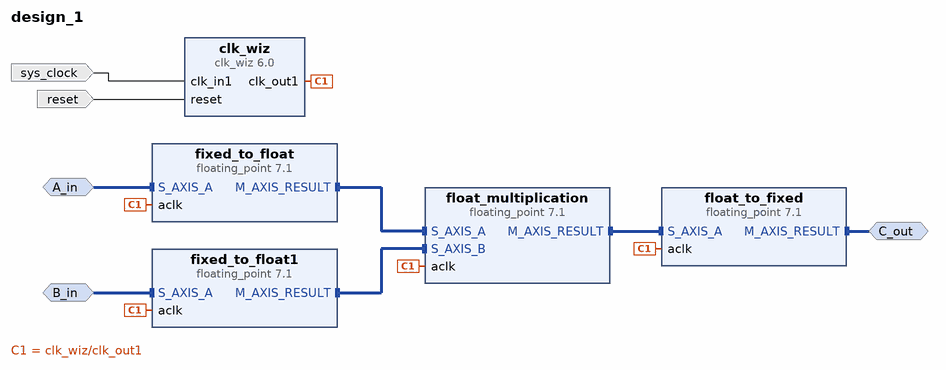
[diagram p0: block diagram of the top level]
# Vivado block design design_1, xc7a35tcpg236-1, Vivado 2019.2
create_bd_design design_1

create_bd_intf_port -mode Slave -vlnv xilinx.com:interface:axis_rtl:1.0 A_in
set_property -dict [list \
  CONFIG.TDATA_NUM_BYTES 4 \
  CONFIG.TDEST_WIDTH 0 \
  CONFIG.TID_WIDTH 0 \
  CONFIG.TUSER_WIDTH 0 \
  CONFIG.HAS_TREADY 1 \
  CONFIG.HAS_TSTRB 0 \
  CONFIG.HAS_TKEEP 0 \
  CONFIG.HAS_TLAST 0 \
  CONFIG.LAYERED_METADATA undef \
] [get_bd_intf_ports A_in]
create_bd_intf_port -mode Slave -vlnv xilinx.com:interface:axis_rtl:1.0 B_in
set_property -dict [list \
  CONFIG.TDATA_NUM_BYTES 4 \
  CONFIG.TDEST_WIDTH 0 \
  CONFIG.TID_WIDTH 0 \
  CONFIG.TUSER_WIDTH 0 \
  CONFIG.HAS_TREADY 1 \
  CONFIG.HAS_TSTRB 0 \
  CONFIG.HAS_TKEEP 0 \
  CONFIG.HAS_TLAST 0 \
  CONFIG.LAYERED_METADATA undef \
] [get_bd_intf_ports B_in]
create_bd_intf_port -mode Master -vlnv xilinx.com:interface:axis_rtl:1.0 C_out
create_bd_port -dir I -type clk sys_clock
set_property -dict {CONFIG.ASSOCIATED_BUSIF A_in:B_in CONFIG.FREQ_HZ 100000000 CONFIG.PHASE 0.000} [get_bd_ports sys_clock]
create_bd_port -dir I -type rst reset
set_property -dict {CONFIG.POLARITY ACTIVE_HIGH} [get_bd_ports reset]

create_bd_cell -type ip -vlnv xilinx.com:ip:floating_point:7.1 float_to_fixed
set_property -dict [list \
  CONFIG.C_Latency 7 \
  CONFIG.C_Mult_Usage No_Usage \
  CONFIG.C_Rate 1 \
  CONFIG.C_Result_Exponent_Width 32 \
  CONFIG.C_Result_Fraction_Width 0 \
  CONFIG.Operation_Type Float_to_fixed \
  CONFIG.Result_Precision_Type Int32 \
] [get_bd_cells float_to_fixed]
create_bd_cell -type ip -vlnv xilinx.com:ip:floating_point:7.1 fixed_to_float
set_property -dict [list \
  CONFIG.C_Accum_Input_Msb 32 \
  CONFIG.C_Accum_Lsb -31 \
  CONFIG.C_Accum_Msb 32 \
  CONFIG.C_Latency 7 \
  CONFIG.C_Mult_Usage No_Usage \
  CONFIG.C_Rate 1 \
  CONFIG.C_Result_Exponent_Width 8 \
  CONFIG.C_Result_Fraction_Width 24 \
  CONFIG.Operation_Type Fixed_to_float \
  CONFIG.Result_Precision_Type Single \
] [get_bd_cells fixed_to_float]
create_bd_cell -type ip -vlnv xilinx.com:ip:floating_point:7.1 float_multiplication
set_property -dict [list \
  CONFIG.C_Latency 9 \
  CONFIG.C_Mult_Usage Full_Usage \
  CONFIG.C_Rate 1 \
  CONFIG.C_Result_Exponent_Width 8 \
  CONFIG.C_Result_Fraction_Width 24 \
  CONFIG.Operation_Type Multiply \
  CONFIG.Result_Precision_Type Single \
] [get_bd_cells float_multiplication]
create_bd_cell -type ip -vlnv xilinx.com:ip:floating_point:7.1 fixed_to_float1
set_property -dict [list \
  CONFIG.C_Accum_Input_Msb 32 \
  CONFIG.C_Accum_Lsb -31 \
  CONFIG.C_Accum_Msb 32 \
  CONFIG.C_Latency 7 \
  CONFIG.C_Mult_Usage No_Usage \
  CONFIG.C_Rate 1 \
  CONFIG.C_Result_Exponent_Width 8 \
  CONFIG.C_Result_Fraction_Width 24 \
  CONFIG.Operation_Type Fixed_to_float \
  CONFIG.Result_Precision_Type Single \
] [get_bd_cells fixed_to_float1]
create_bd_cell -type ip -vlnv xilinx.com:ip:clk_wiz:6.0 clk_wiz
set_property -dict [list \
  CONFIG.CLK_IN1_BOARD_INTERFACE sys_clock \
  CONFIG.RESET_BOARD_INTERFACE reset \
  CONFIG.USE_BOARD_FLOW true \
] [get_bd_cells clk_wiz]

# ---- connections ----

connect_bd_intf_net [get_bd_intf_pins fixed_to_float/M_AXIS_RESULT] [get_bd_intf_pins float_multiplication/S_AXIS_A]
connect_bd_intf_net [get_bd_intf_pins fixed_to_float1/M_AXIS_RESULT] [get_bd_intf_pins float_multiplication/S_AXIS_B]
connect_bd_intf_net [get_bd_intf_ports C_out] [get_bd_intf_pins float_to_fixed/M_AXIS_RESULT]
connect_bd_intf_net -intf_net S_AXIS_A_1_1 [get_bd_intf_ports B_in] [get_bd_intf_pins fixed_to_float1/S_AXIS_A]
connect_bd_intf_net -intf_net Matrix_A_in [get_bd_intf_ports A_in] [get_bd_intf_pins fixed_to_float/S_AXIS_A]
connect_bd_intf_net [get_bd_intf_pins float_multiplication/M_AXIS_RESULT] [get_bd_intf_pins float_to_fixed/S_AXIS_A]
connect_bd_net [get_bd_pins clk_wiz/clk_out1] \
  [get_bd_pins float_multiplication/aclk] [get_bd_pins float_to_fixed/aclk] [get_bd_pins fixed_to_float1/aclk] \
  [get_bd_pins fixed_to_float/aclk]
connect_bd_net [get_bd_ports sys_clock] [get_bd_pins clk_wiz/clk_in1]
connect_bd_net [get_bd_ports reset] [get_bd_pins clk_wiz/reset]

validate_bd_design
save_bd_design
